# Altium schematic sheet cpu.SchDoc
size A4
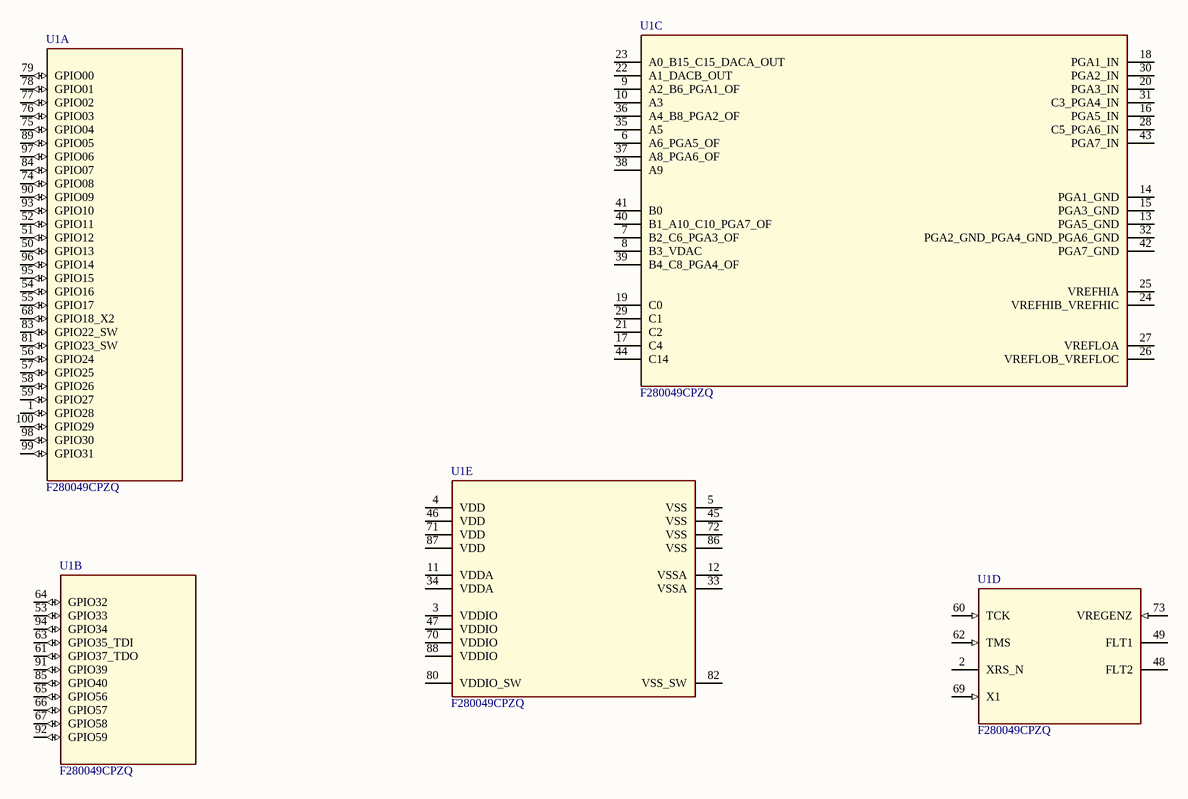
[diagram p0: cpu.SchDoc]

## Parts
U1  F280049CPZQ  [PZ0100A_M]  (parts A,B,C,D,E of 5)

## Nets

Not connected (* = marked no-connect by the designer): U1 1(GPIO28) 2(XRS_N) 3(VDDIO) 4(VDD) 5(VSS) 6(A6_PGA5_OF) 7(B2_C6_PGA3_OF) 8(B3_VDAC) 9(A2_B6_PGA1_OF) 10(A3) 11(VDDA) 12(VSSA) 13(PGA5_GND) 14(PGA1_GND) 15(PGA3_GND) 16(PGA5_IN) 17(C4) 18(PGA1_IN) 19(C0) 20(PGA3_IN) 21(C2) 22(A1_DACB_OUT) 23(A0_B15_C15_DACA_OUT) 24(VREFHIB_VREFHIC) 25(VREFHIA) 26(VREFLOB_VREFLOC) 27(VREFLOA) 28(C5_PGA6_IN) 29(C1) 30(PGA2_IN) 31(C3_PGA4_IN) 32(PGA2_GND_PGA4_GND_PGA6_GND) 33(VSSA) 34(VDDA) 35(A5) 36(A4_B8_PGA2_OF) 37(A8_PGA6_OF) 38(A9) 39(B4_C8_PGA4_OF) 40(B1_A10_C10_PGA7_OF) 41(B0) 42(PGA7_GND) 43(PGA7_IN) 44(C14) 45(VSS) 46(VDD) 47(VDDIO) 48(FLT2) 49(FLT1) 50(GPIO13) 51(GPIO12) 52(GPIO11) 53(GPIO33) 54(GPIO16) 55(GPIO17) 56(GPIO24) 57(GPIO25) 58(GPIO26) 59(GPIO27) 60(TCK) 61(GPIO37_TDO) 62(TMS) 63(GPIO35_TDI) 64(GPIO32) 65(GPIO56) 66(GPIO57) 67(GPIO58) 68(GPIO18_X2) 69(X1) 70(VDDIO) 71(VDD) 72(VSS) 73(VREGENZ) 74(GPIO08) 75(GPIO04) 76(GPIO03) 77(GPIO02) 78(GPIO01) 79(GPIO00) 80(VDDIO_SW) 81(GPIO23_SW) 82(VSS_SW) 83(GPIO22_SW) 84(GPIO07) 85(GPIO40) 86(VSS) 87(VDD) 88(VDDIO) 89(GPIO05) 90(GPIO09) 91(GPIO39) 92(GPIO59) 93(GPIO10) 94(GPIO34) 95(GPIO15) 96(GPIO14) 97(GPIO06) 98(GPIO30) 99(GPIO31) 100(GPIO29)

## Library data of the parts
U1 = F280049CPZQ: No Description Available; Manufacturer: Texas Instruments; PartNumber: F280049CPZQ; RefDes: RefDes; Type: DEV; Value: Value; Copyright: Copyright (C) 2018 Accelerated Designs. All rights reserved